# EAGLE design BusinessCard (EAGLE 9.7.0)
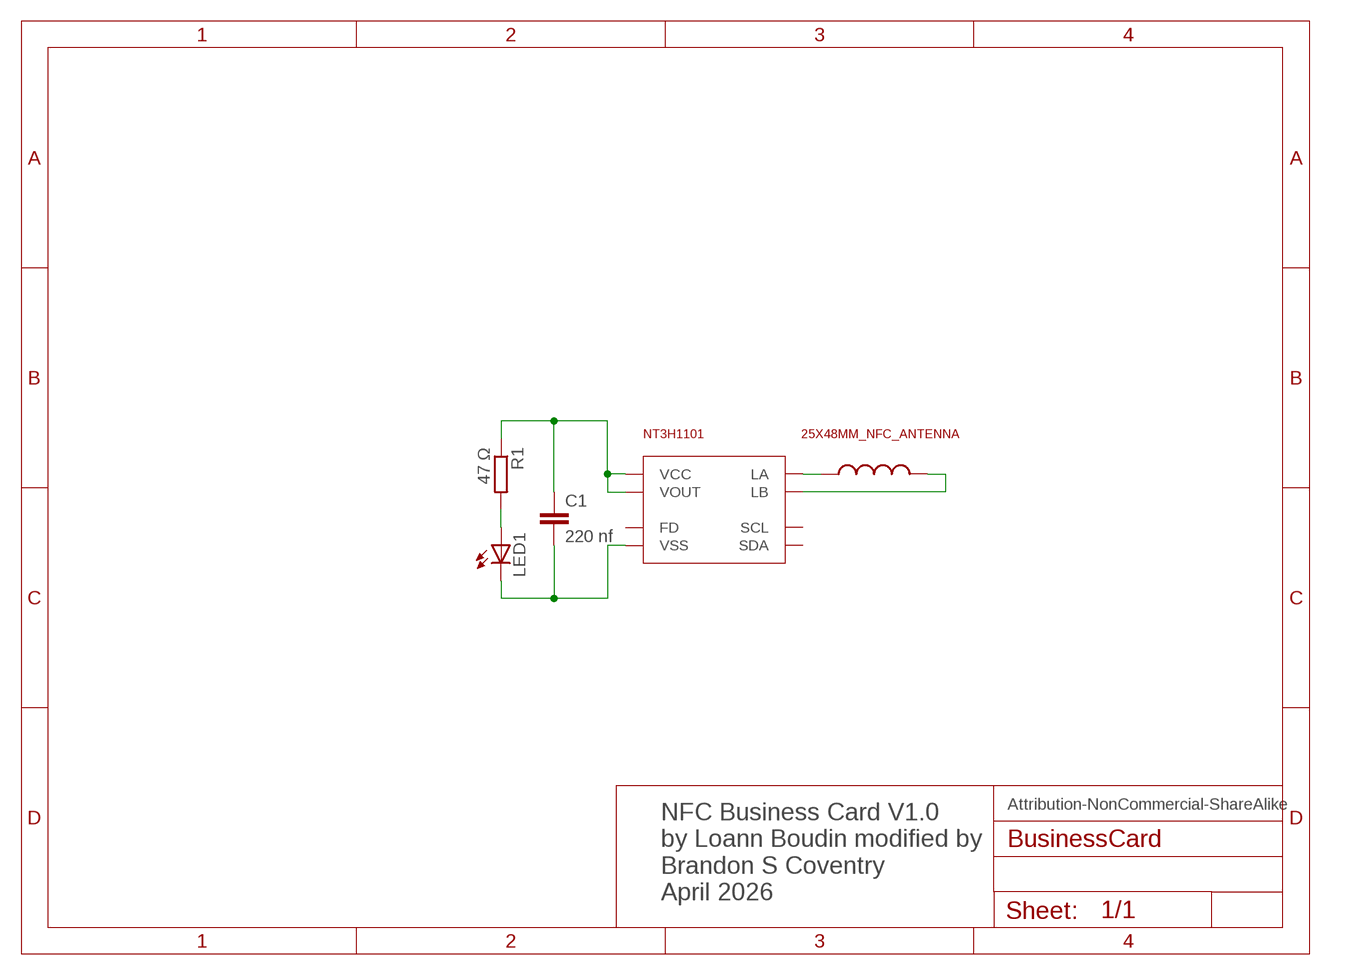
[diagram p0: schematic, sheet 1]

## Parts
ANT  25X48MM_NFC_ANTENNA  [25X48MM_NFC]
C1  220 nf  C-EUC0603  [C0603]
LED1  LEDSML0805  [SML0805]
NT3H1101  NT3H  [XQFN8]
R1  47 Ω  R-EU_R0603  [R0603]

## Nets
N$1: ANT.P$2 NT3H1101.LA
N$2: ANT.P$1 NT3H1101.LB
N$3: C1.1 NT3H1101.VCC NT3H1101.VOUT R1.1
N$4: LED1.A R1.2
N$6: C1.2 LED1.C NT3H1101.VSS
Unconnected: NT3H1101.FD NT3H1101.SCL NT3H1101.SDA

## Notes on the sheet
- Attribution-NonCommercial-ShareAlike
- NFC Business Card V1.0
  by Loann Boudin modified by 
  Brandon S Coventry
  April 2026

## Library data of the parts
ANT = PCB_BusinessCard:25X48MM_NFC_ANTENNA: 25x48 mm NFC loop antenna, L = 2,75 µH
C1 = resistor:C-EU: CAPACITOR, European symbol
LED1 = led:LED: LED OSRAM: - CHIPLED LG R971, LG N971, LY N971, LG Q971, LY Q971, LO R971, LY R971 LH N974, LH R974 LS Q976, LO Q976, LY Q976 LO Q996 - Hyper CHIPLED LW Q18S LB Q993, LB Q99A, LB R99A - SideLED LS A670, LO A670, LY A670, LG A670, LP A670 LB A673, LV A673, LT A673, LW A673 LH A674 LY A675 LS A676, LA A676, LO A676, LY A676, LW A676 LS A679, LY A679, LG A679 - Hyper Micro SIDELED® LS Y876, LA Y876, LO Y876, LY Y876 LT Y87S - SmartLED LW L88C, LW L88S LB L89C, LB L89S, LG L890 LS L89K, LO L89K, LY L89K LS L896, LA L896, LO L896, LY L896 - TOPLED LS T670, LO T670, LY T670, LG T670, LP T670 LSG T670, LSP T670, LSY T670, LOP T670, LYG T670 LG T671, LOG T671, LSG T671 LB T673, LV T673, LT T673, LW T673 LH T674 LS T676, LA T676, LO T676, LY T676, LB T676, LH T676, LSB T676, LW T676 LB T67C, LV T67C, LT T67C, LS T67K, LO T67K, LY T67K, LW E67C LS E67B, LA E67B, LO E67B, LY E67B, LB E67C, LV E67C, LT E67C LW T67C LS T679, LY T679, LG T679 LS T770, LO T770, LY T770, LG T770, LP T770 LB T773, LV T773, LT T773, LW T773 LH T774 LS E675, LA E675, LY E675, LS T675 LS T776, LA T776, LO T776, LY T776, LB T776 LHGB T686 LT T68C, LB T68C - Hyper Mini TOPLED® LB M676 - Mini TOPLED Santana® LG M470 LS M47K, LO M47K, LY M47K Source: http://www.osram.convergy.de LUXEON: - LUMILED® LXK2-PW12-R00, LXK2-PW12-S00, LXK2-PW14-U00, LXK2-PW14-V00 LXK2-PM12-R00, LXK2-PM12-S00, LXK2-PM14-U00 LXK2-PE12-Q00, LXK2-PE12-R00, LXK2-PE12-S00, LXK2-PE14-T00, LXK2-PE14-U00 LXK2-PB12-K00, LXK2-PB12-L00, LXK2-PB12-M00, LXK2-PB14-N00, LXK2-PB14-P00, LXK2-PB14-Q00 LXK2-PR12-L00, LXK2-PR12-M00, LXK2-PR14-Q00, LXK2-PR14-R00 LXK2-PD12-Q00, LXK2-PD12-R00, LXK2-PD12-S00 LXK2-PH12-R00, LXK2-PH12-S00 LXK2-PL12-P00, LXK2-PL12-Q00, LXK2-PL12-R00 Source: www.luxeon.com KINGBRIGHT: KA-3528ASYC Source: www.kingbright.com
NT3H1101 = PCB_BusinessCard:NT3H
R1 = resistor:R-EU_: RESISTOR, European symbol

## Board
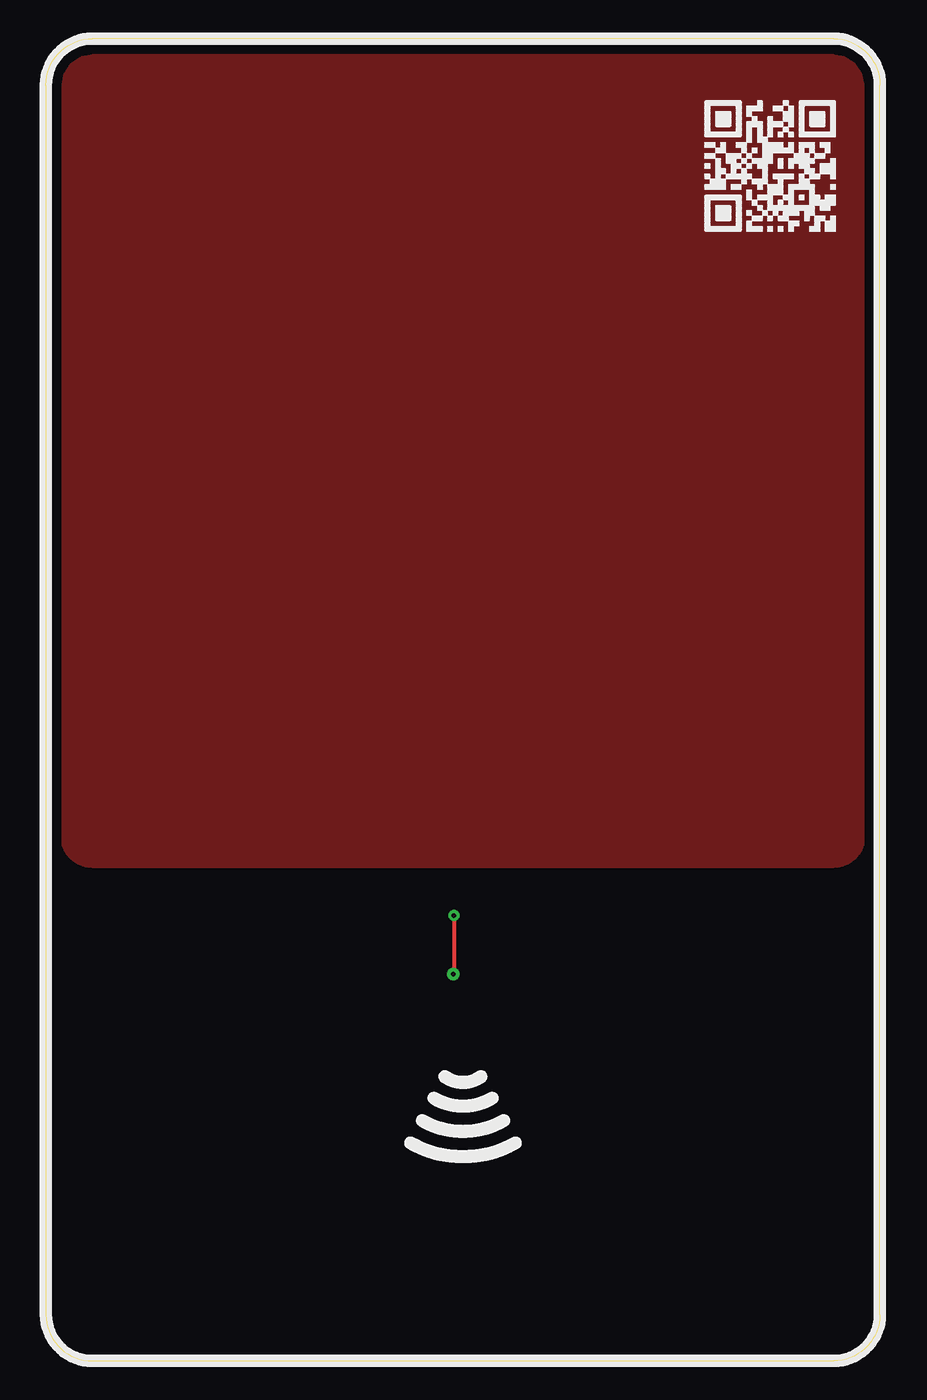
[diagram p1: board, top side]
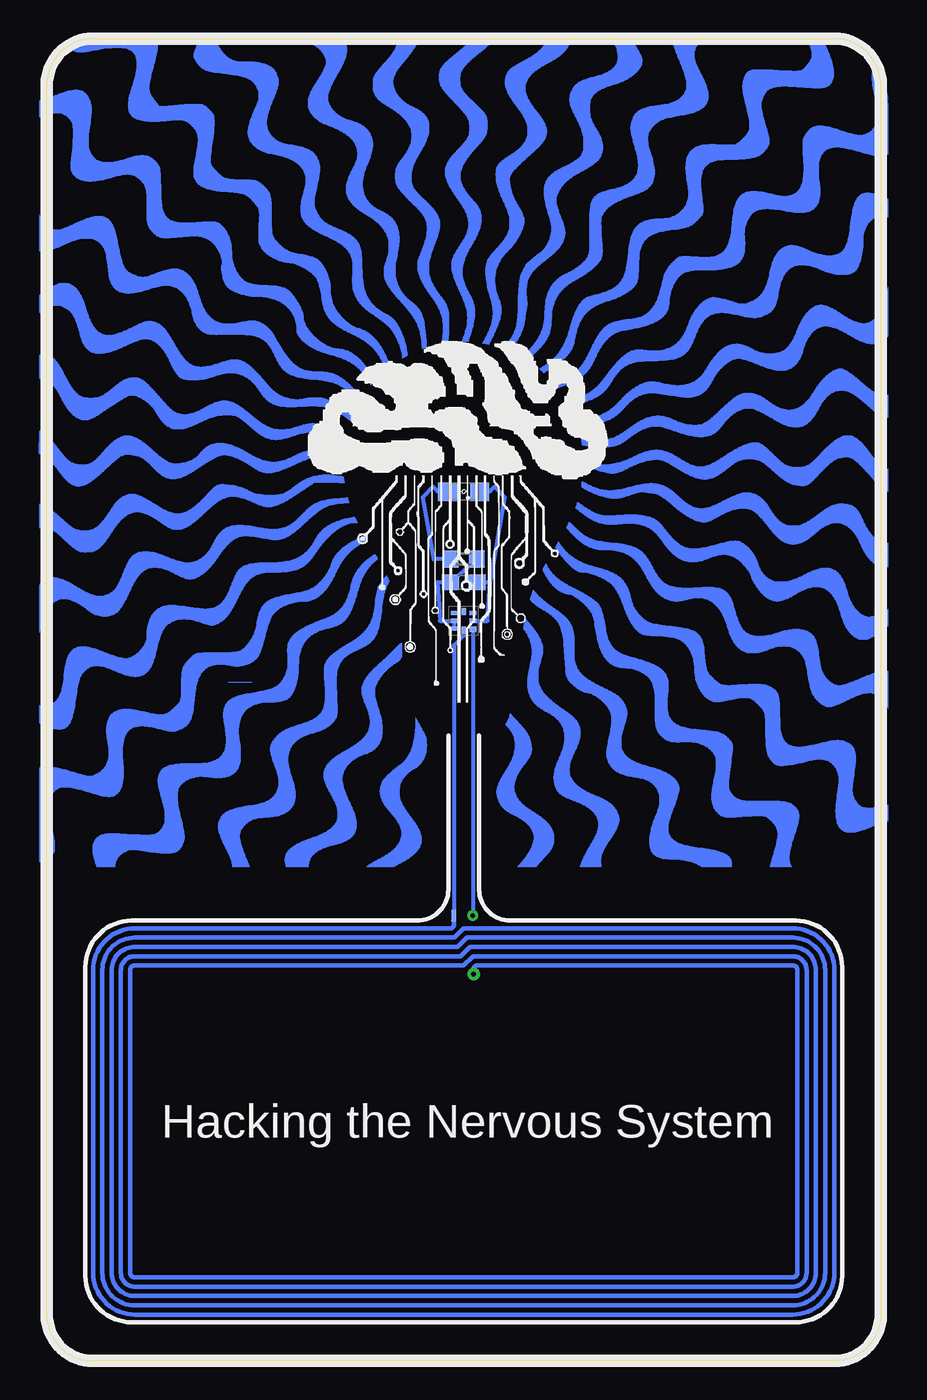
[diagram p2: board, bottom side, seen from below]

Size 54 x 85.6 mm. Coordinates in mm from the lower left corner, seen from the top.
Outline: 3,0 51,0 arc90 54,3 54,82.6 arc90 51,85.6 3,85.6 arc90 0,82.6 0,3 arc90 3,0
Copper layers (1*16): Top / Bottom
Stack-up Default Layer Stack: Top User Defined 0.035mm / Dielectric-1 User Defined 1.5mm / Bottom User Defined 0.035mm
Design rules: minimum copper width 6mil, minimum drill size 0.35mm, copper clearance wire_polygon to wire_polygon 6mil, copper clearance wire_polygon to pad_smd 6mil, copper clearance wire_polygon to via 6mil, copper clearance pad_smd to pad_smd 6mil, copper clearance pad_smd to via 6mil, copper clearance via to via 6mil, copper clearance smd to pad (same net) 6mil, copper clearance smd to via (same net) 6mil, copper clearance smd to smd (same net) 6mil, dimension clearance 40mil, via restrict clearance 0mil, restrict clearance 0mil, drill distance 6mil, keepout clearance 0mil

### Footprints (pad centres in the part's own frame; a part is rotated, then mirrored left to right if it is on the bottom)
25X48MM_NFC = smd 0.3 x 0.75: P$1 -0.635,13.335 | drill 0.3: P$2 0.635,9.525
C0603 = smd 1.1 x 1: 1 -0.85,0; 2 0.85,0
SML0805 = smd 1.2 x 1.2: A 1.05,0; C -1.05,0
XQFN8 = smd 0.27 x 0.45: FD 0,-0.6; LB 0,0.6 | smd 0.45 x 0.37: LA -0.6,0.55 | smd 0.45 x 0.27: SCL -0.6,-0.5; SDA 0.6,-0.5; VCC 0.6,0; VOUT 0.6,0.5; VSS -0.6,0
R0603 = smd 1 x 1.1: 1 -0.85,0; 2 0.85,0

### Placement (x,y rotation side)
ANT  27,15.5 0 bottom
C1  27,50.4 0 bottom
LED1  27,56.27 180 bottom
NT3H1101  27,47.91 180 bottom
R1  27,51.9 180 bottom

### Tracks (layer width: path | path; a pad name or v marks a point on that pad's centre or on a via)
N$1  (via drill 0.3)
  Top 0.25: v26.42,28.83 26.42,25.08 ANT.P$2
  Bottom 0.25: NT3H1101.LA 26.4,28.85 v26.42,28.83
N$2
  Bottom 0.25: ANT.P$1 27.64,46.32 27,46.95 NT3H1101.LB
N$3
  Bottom 0.25: R1.1 C1.1 28.7,50.4 28.55,47.91 NT3H1101.VCC NT3H1101.VOUT
N$4
  Bottom 0.25: LED1.A 28.7,56.3 29,56.6 29.66,55.9 28.95,51.9 28.19,51.9
  Bottom 0.254: R1.2 28.19,51.9
N$6
  Bottom 0.25: LED1.C 25.3,56.3 25,56.6 24.35,55.91 25.3,50.4 | 25.3,50.4 C1.2 | NT3H1101.VSS 25.45,47.91 25.3,50.4
N$9
  pour Top: 51.32,31.95 51.64,32.03 51.94,32.15 52.22,32.32 52.47,32.53 52.68,32.78 52.85,33.06 52.97,33.36 53.05,33.68 53.08,34 53.08,82.5 53.05,82.82 52.97,83.14 52.85,83.44 52.68,83.72 52.47,83.97 52.22,84.18 51.94,84.35 51.64,84.47 51.32,84.55 51,84.58 3,84.58 2.68,84.55 2.36,84.47 2.06,84.35 1.78,84.18 1.53,83.97 1.32,83.72 1.15,83.44 1.03,83.14 0.95,82.82 0.93,82.5 0.93,34 0.95,33.68 1.03,33.36 1.15,33.06 1.32,32.78 1.53,32.53 1.78,32.32 2.06,32.15 2.36,32.03 2.68,31.95 3,31.93 51,31.93
(copper drawn outside any net)
  shapes: Bottom area x21821

### Text on the board
bPlace: Hacking the Nervous System
tStop: Brandon S Coventry, PhD / / Neural Engineer / Medical Device Architect / / bscoventry@gmail.com / coventry@wisc.edu / / bscoventry.github.io